# EAGLE design Grove - NFC Tag v1.0 (EAGLE 6.4)

## Sheet 1 of 2
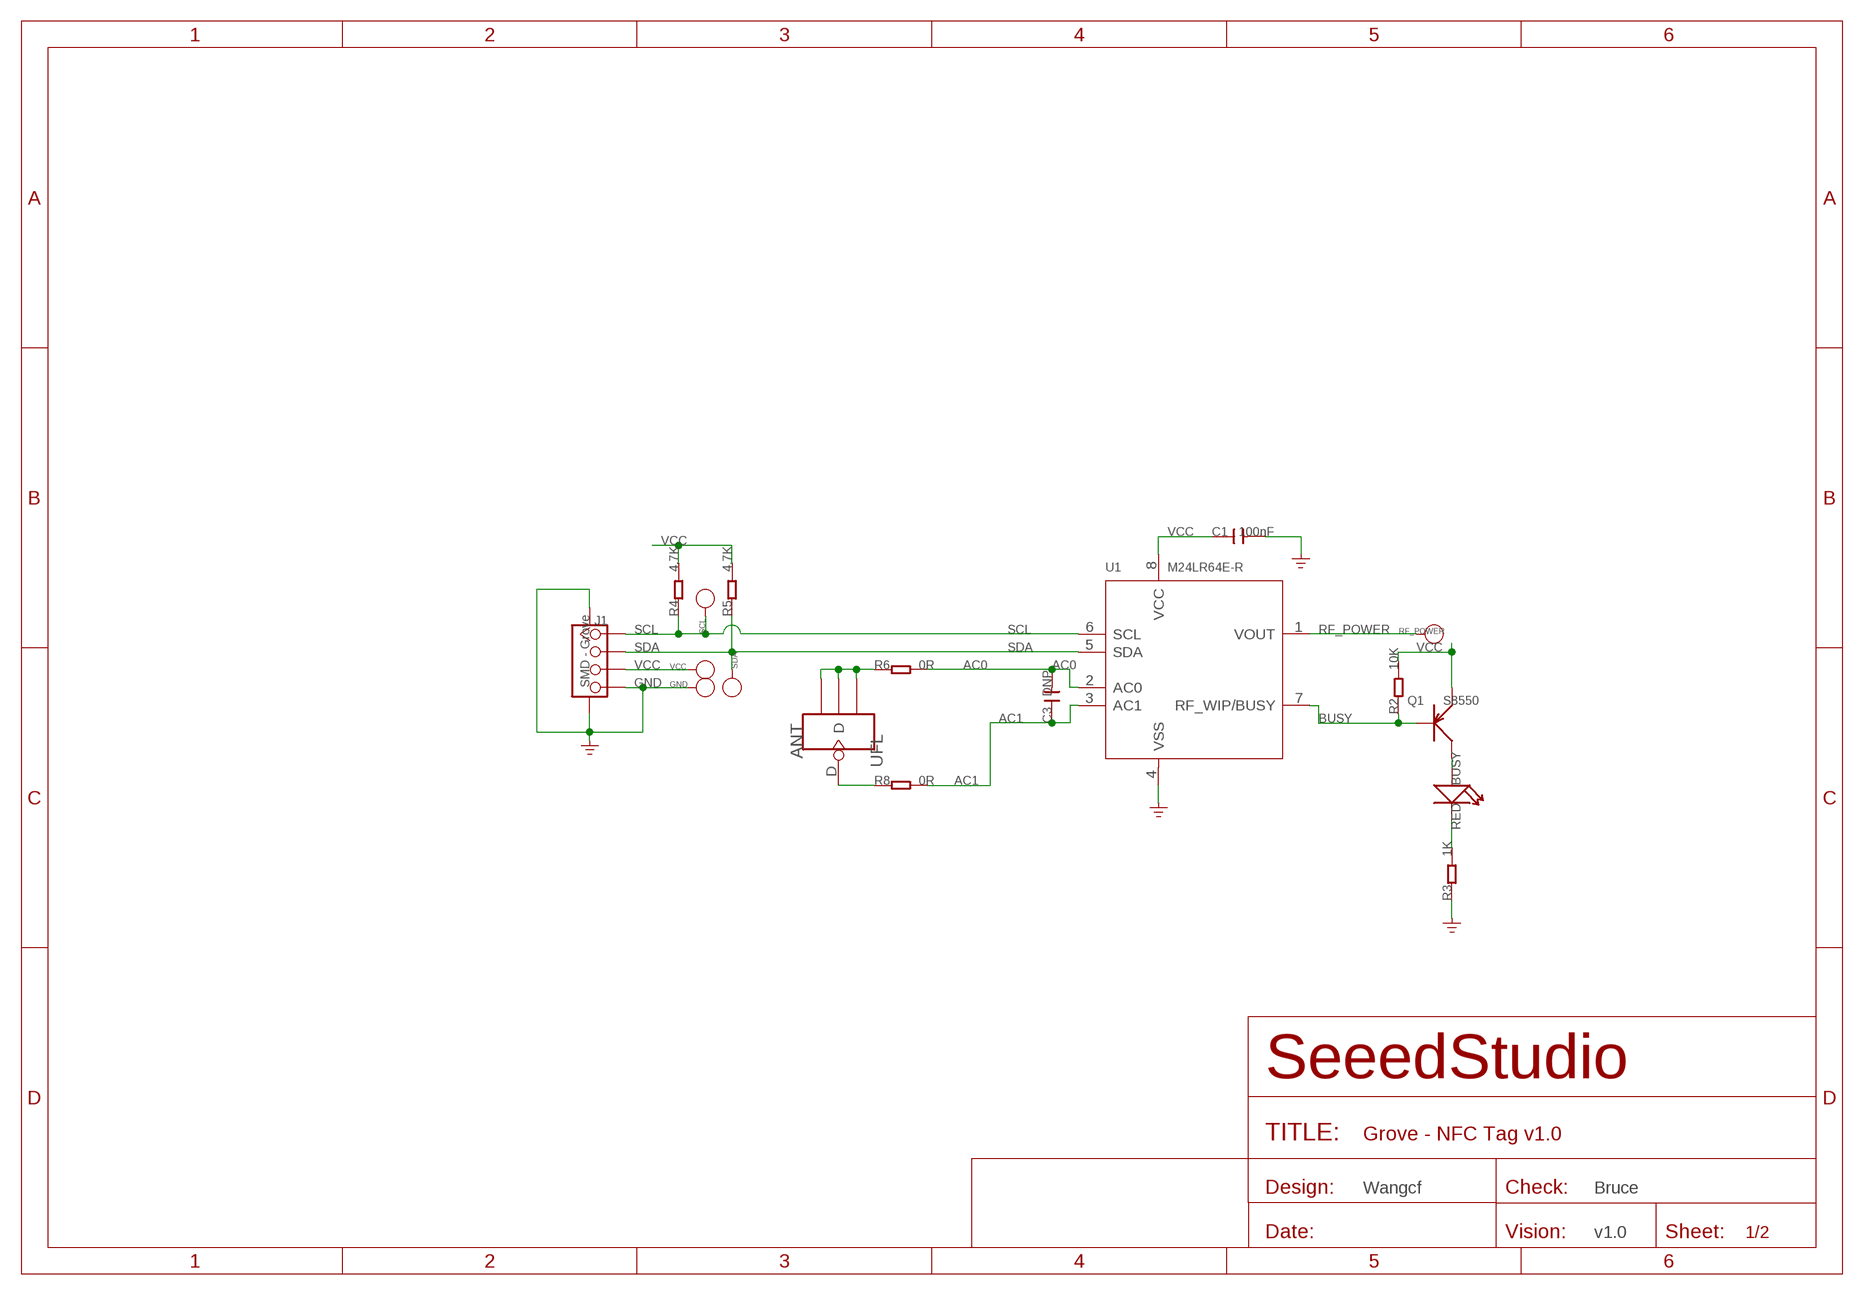
[diagram p0: schematic, sheet 1]

### Parts
ANT  UFL  ANTENNA-U-FL  [4P-U-FL]
BUSY  RED  LED'0603'  [LED-0603]
C1  100nF  C-0402  [C0402]
C3  DNP  C-0402  [C0402]
GND  PAD-TEST-POINT'4545'  [TP_4545]
J1  SMD - Grove  TWIG-4P-2.0-SMD-FEMALE-REINFORCE'DD'  [4P-SMD-2.0]
Q1  S8550  TRANSISTOR-PNP-SOT23  [SOT23]
R2  10K  R-0402  [R0402]
R3  1K  R-0402  [R0402]
R4  4.7K  R-0402  [R0402]
R5  4.7K  R-0402  [R0402]
R6  0R  R-0402  [R0402]
R8  0R  R-0402  [R0402]
RF_POWER  PAD-TEST-POINT'4545'  [TP_4545]
SCL  PAD-TEST-POINT'4545'  [TP_4545]
SDA  PAD-TEST-POINT'4545'  [TP_4545]
U1  M24LR64E-R  [TSSOP8]
VCC  PAD-TEST-POINT'4545'  [TP_4545]

### Nets
AC0: C3.2 R6.2 U1.2(AC0)
AC1: C3.1 R8.2 U1.3(AC1)
BUSY: Q1.1(B) R2.1 U1.7(RF_WIP/BUSY)
GND: C1.2 GND.T J1.4 J1.SS1 J1.SS2 R3.1 U1.4(VSS)
N$3: BUSY.+ Q1.3(C)
N$9: BUSY.- R3.2
N$17: ANT.D R8.1
N$18: ANT.GND1 ANT.GND2 ANT.GND3 R6.1
RF_POWER: RF_POWER.T U1.1(VOUT)
SCL: J1.1 R4.1 SCL.T U1.6(SCL)
SDA: J1.2 R5.1 SDA.T U1.5(SDA)
VCC: C1.1 J1.3 Q1.2(E) R2.2 R4.2 R5.2 U1.8(VCC) VCC.T

### Notes on the sheet
- Wangcf | Bruce
- v1.0

## Sheet 2 of 2
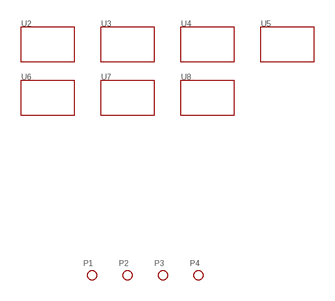
[diagram p1: schematic, sheet 2]

### Parts
P1  PAD-MARK  [ROUND-MARK-1.0]
P2  PAD-MARK  [ROUND-MARK-1.0]
P3  PAD-MARK  [ROUND-MARK-1.0]
P4  PAD-MARK  [ROUND-MARK-1.0]
U2  TWIG'2U'  [GROVE-TEST-PLATFORM]
U3  TWIG'2U'  [GROVE-TEST-PLATFORM]
U4  TWIG'2U'  [GROVE-TEST-PLATFORM]
U5  TWIG'2U'  [GROVE-TEST-PLATFORM]
U6  TWIG'2U'  [GROVE-TEST-PLATFORM]
U7  TWIG'2U'  [GROVE-TEST-PLATFORM]
U8  TWIG'2U'  [GROVE-TEST-PLATFORM]

## Library data of the parts
ANT = Connector:ANTENNA-U-FL
BUSY = Discrete:LED*
C1 C3 = Discrete:C*: Ceramic Capacitors
GND RF_POWER SCL SDA VCC = Discrete:PAD-TEST-POINT; PARTNO: DNP
J1 = Connector :TWIG-4P-2.0-SMD-FEMALE-REINFORCE
P1-P4 = Discrete:PAD-MARK; PARTNO: DNP
Q1 = Discrete:TRANSISTOR-PNP*: PNP audion
R2-R6 R8 = Discrete:R*
U1 = template:M24LR64E-R: Dynamic NFC/RFID tag IC with 64-Kbit EEPROM, energy harvesting, I²C bus and ISO 15693 RF interface
U2-U8 = template:TWIG

## Net classes
0 default: width 0.203 mm, drill 0.305 mm, clearance 0.152 mm

## Board
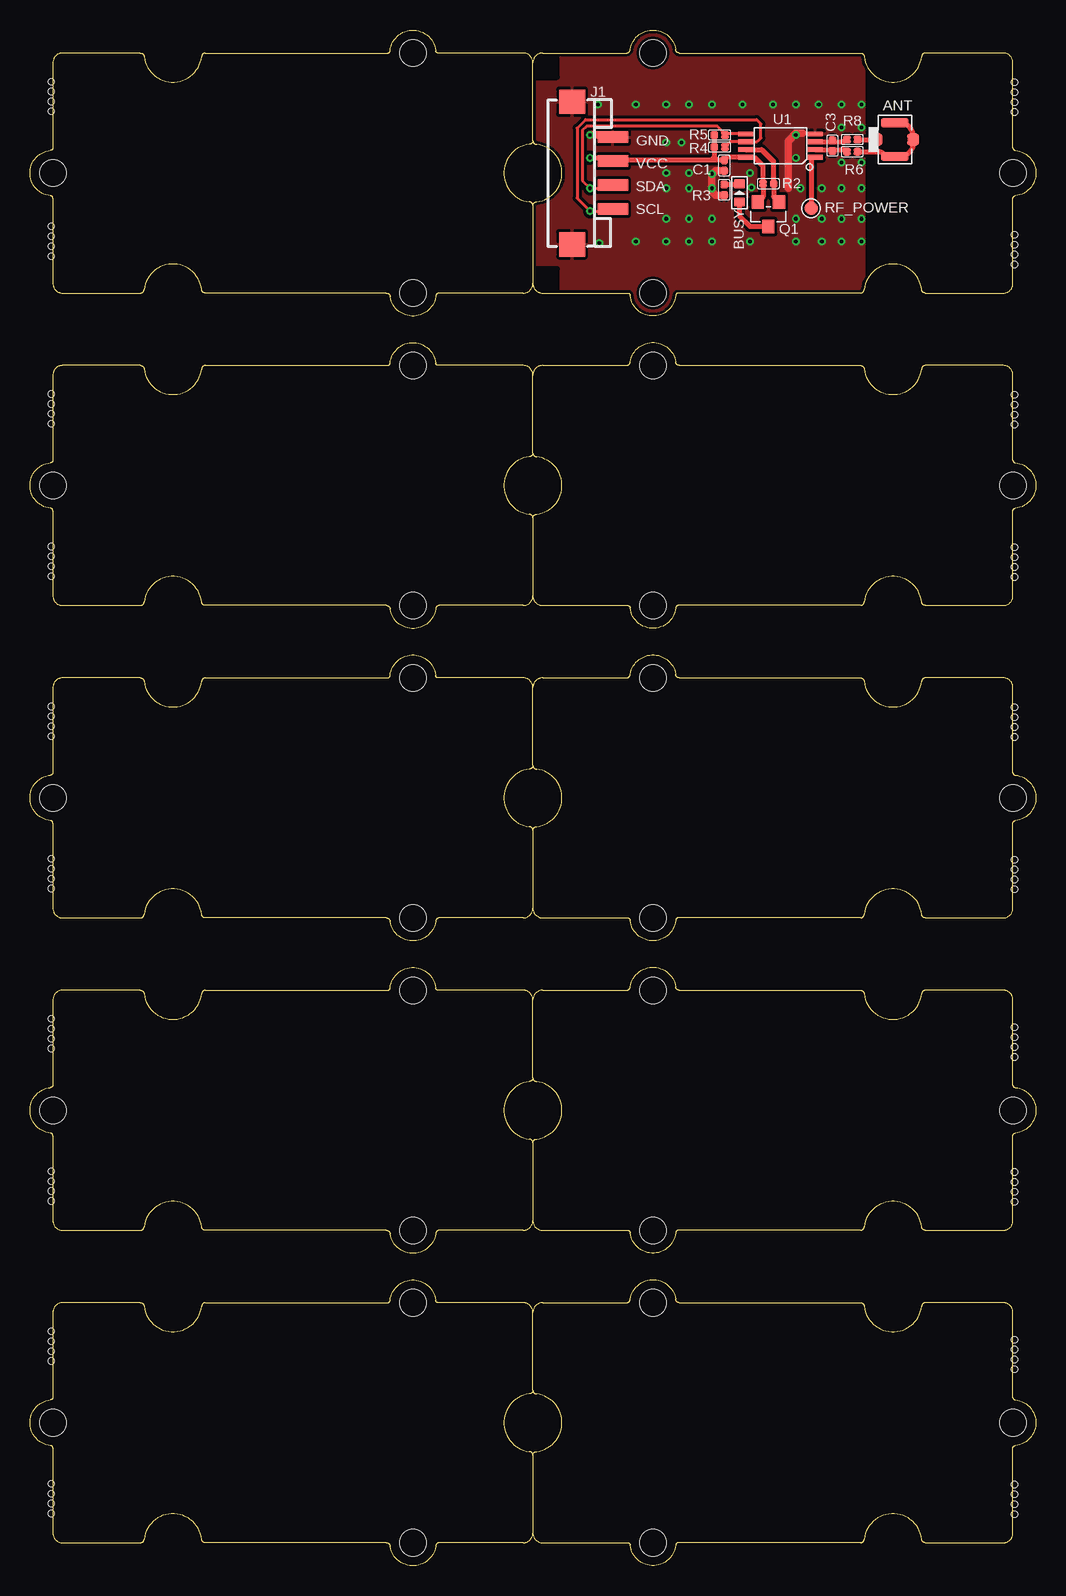
[diagram p2: board, top side]
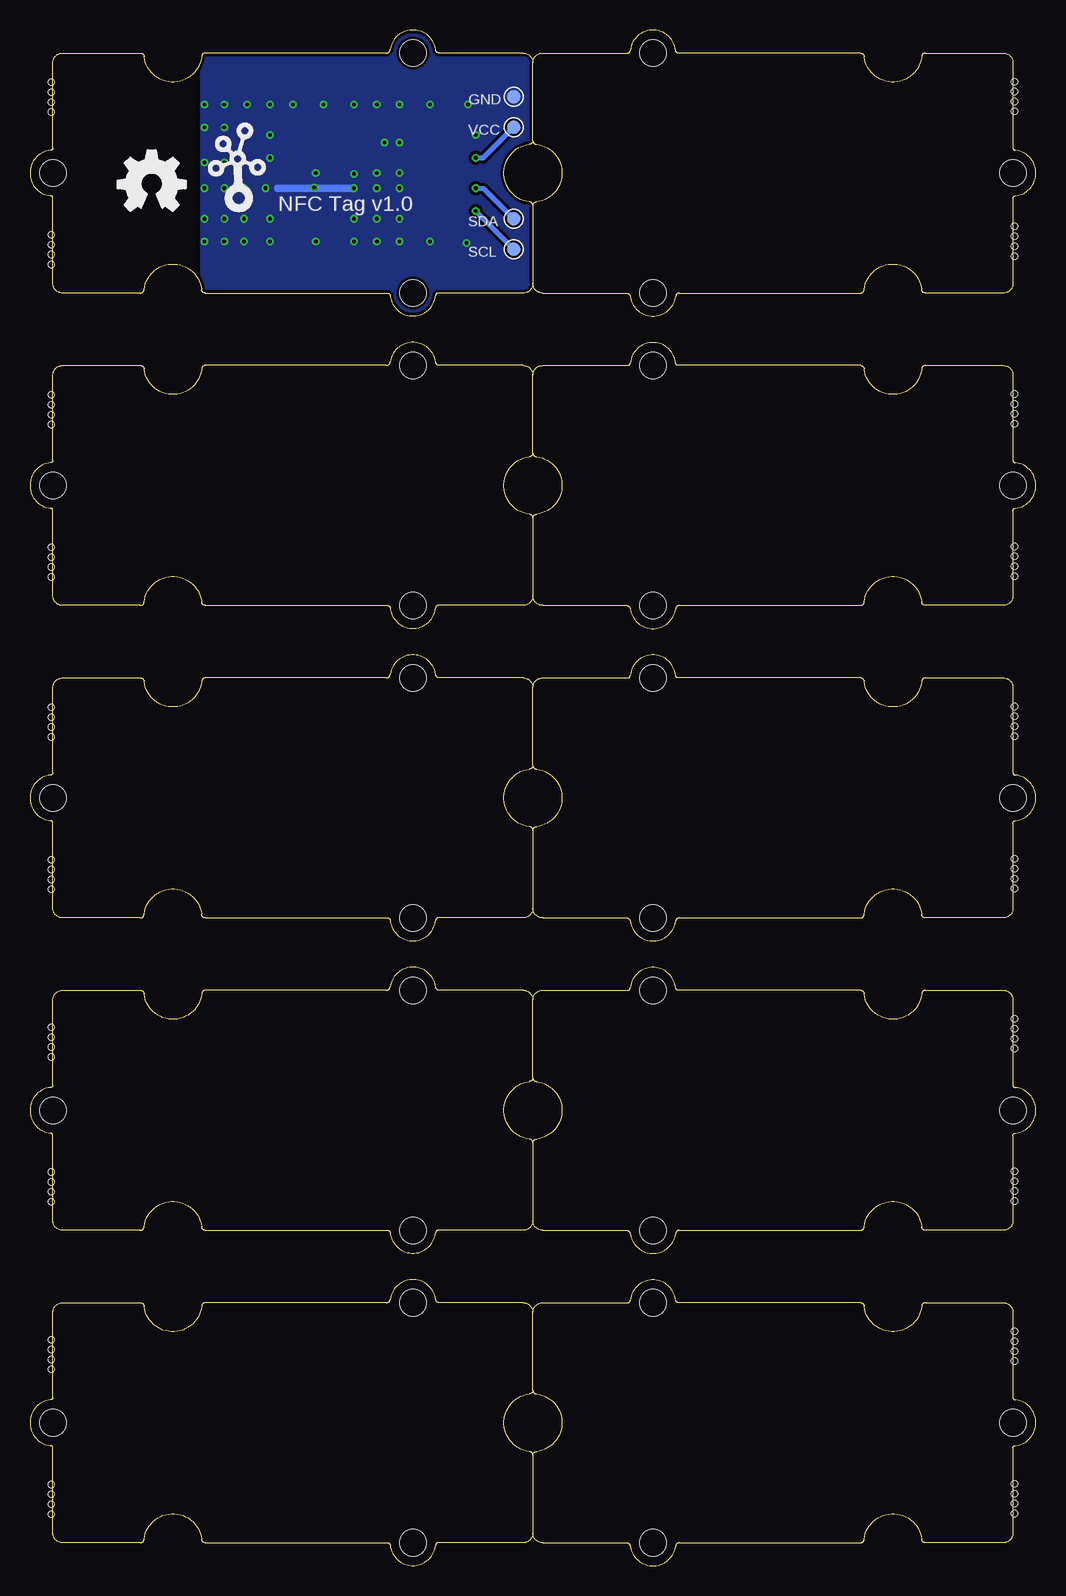
[diagram p3: board, bottom side, seen from below]

Size 83.82 x 127.98 mm. Coordinates in mm from the lower left corner, seen from the top.
Copper layers (1*16): Top 0.035mm / dielectric 1.5mm / Bottom 0.035mm
Design rules "SeeedStudio_2layer_DRU_no_angle_20140221 *": minimum track width 6mil, minimum drill 12mil, track to track 6mil, track to pad 6mil, pad to pad 6mil, via to via 6mil, smd to smd 0mil, copper to edge 10mil, drill to drill 10mil, minimum pad ring 10mil, minimum via ring 6mil, stop-mask expansion 2mil, vias tented up to drill 25mil, thermal gap 10mil
Holes 0.5 mm at 1.78,32.88 1.78,30.4 1.78,31.23 1.78,32.05 1.78,45.58 1.78,43.1 1.78,43.93 1.78,44.75 1.78,58.91 1.78,56.43 1.78,57.26 1.78,58.09 1.78,71.61 1.78,69.13 1.78,69.96 1.78,70.79 1.78,84.95 1.78,82.47 1.78,83.3 1.78,84.12 1.78,97.65 1.78,95.17 1.78,96 1.78,96.82 1.78,111.62 1.78,109.14 1.78,109.97 1.78,110.79 1.78,123.68 1.78,121.2 1.78,122.03 1.78,122.86 82.04,121.14 82.04,123.62 82.04,122.79 82.04,121.97 82.04,108.44 82.04,110.92 82.04,110.09 82.04,109.27 82.04,95.11 82.04,97.58 82.04,96.76 82.04,95.93 82.04,82.41 82.04,84.88 82.04,84.06 82.04,83.23 82.04,69.07 82.04,71.55 82.04,70.72 82.04,69.9 82.04,56.37 82.04,58.85 82.04,58.02 82.04,57.2 82.04,42.4 82.04,44.88 82.04,44.05 82.04,43.23 82.04,30.34 82.04,32.81 82.04,31.99 82.04,31.16 1.78,6.84 1.78,4.36 1.78,5.19 1.78,6.02 1.78,19.54 1.78,17.06 1.78,17.89 1.78,18.72 82.04,16.37 82.04,18.84 82.04,18.02 82.04,17.19 82.04,4.3 82.04,6.78 82.04,5.95 82.04,5.13
Holes 1.91 mm at -4.13,2.4 87.95,2.4 87.95,125.59 -4.13,125.59

### Footprints (pad centres in the part's own frame; a part is rotated, then mirrored left to right if it is on the bottom)
4P-U-FL = smd 1.016 x 1.016: D -1.524,0; GND3 1.524,0 | smd 2.286 x 0.762: GND1 0,1.397; GND2 0,-1.397
LED-0603 = smd 0.762 x 0.889: + -0.762,0; - 0.762,0
C0402 = smd 0.635 x 0.635: 1 -0.445,0; 2 0.445,0
TP_4545 = smd 1.143 x 1.143: T 0,0
4P-SMD-2.0 = smd 0.965 x 2.54: 1 -3,0; 2 -1,0; 3 1,0; 4 3,0 | smd 2.032 x 2.184: SS1 -5.946,3.4; SS2 5.946,3.4
ROUND-MARK-1.0 = smd 1.016 x 1.016: P$1 0,0
SOT23 = smd 1.016 x 1.143: 1 -0.889,-1.016; 2 0.889,-1.016; 3 0,1.016
R0402 = smd 0.635 x 0.635: 1 -0.445,0; 2 0.445,0
TSSOP8 = smd 0.4 x 1.27: 1 -0.975,-2.9; 2 -0.325,-2.9; 3 0.325,-2.9; 4 0.975,-2.9; 5 0.975,2.9; 6 0.325,2.9; 7 -0.325,2.9; 8 -0.975,2.9
GROVE-TEST-PLATFORM = hole 2.2: -10,-10; -10,10; 20,0
GROVE-2CONNECTOR-SMD = hole 2.2: -10,-10; -10,10; 20,0

### Placement (x,y rotation side)
ANT  72.07,118.86 0 top
BUSY  59.12,114.41 90 top
C1  57.85,116.7 270 top
C3  66.87,118.35 270 top
GND  43.5,122.41 180 bottom
J1  48.58,116.06 90 top
P1  -4.13,7.48 0 top  (outside the outline)
P2  87.95,7.48 0 top  (outside the outline)
P3  -4.13,120.51 0 top  (outside the outline)
P4  87.95,120.51 0 top  (outside the outline)
Q1  61.53,112.63 180 top
R2  61.53,115.17 180 top
R3  57.85,114.66 90 top
R4  57.47,118.22 180 top
R5  57.47,119.24 180 top
R6  68.52,117.84 180 top
R8  68.52,118.86 180 top
RF_POWER  65.09,113.14 0 top
SCL  43.5,109.71 180 bottom
SDA  43.5,112.25 180 bottom
U1  62.55,118.35 90 top
U2  61.91,37.96 0 top
U3  21.91,37.96 180 top
U4  61.91,63.99 0 top
U5  21.91,63.99 180 top
U6  61.91,90.03 0 top
U7  21.91,90.03 180 top
U8  21.91,116.06 180 top
U10  [GROVE-TEST-PLATFORM]  61.91,11.92 0 top
U11  [GROVE-TEST-PLATFORM]  21.91,11.92 180 top
U$4  [OSHW_FILLX200_NOTEXT]  76.52,112.89 0 bottom
U$5  [GROVE-2CONNECTOR-SMD]  61.91,116.06 0 top
U$6  [TWIGLOGO]  66.49,113.78 0 bottom
VCC  43.5,119.87 180 bottom

### Tracks (layer width: path | path; a pad name or v marks a point on that pad's centre or on a via)
AC0
  Top 0.254: 66.68,118.02 66.75,118.02 C3.2
  Top 0.406: U1.2 66.68,118.02 67.63,118.02 arc-45 R6.2
AC1
  Top 0.254: 66.68,118.67 66.75,118.67 C3.1
  Top 0.406: U1.3 66.68,118.67 67.63,118.67 arc45 R8.2
BUSY
  Top 0.406: 62.29,113.78 Q1.1 61.98,114.09 R2.1 61.98,117.01 60.97,118.02 U1.7
GND  (via drill 0.3 pad 0.64)
  Top 0.254: 45.07,110.22 J1.SS1
  Top 0.305: U1.4 64.43,119.32 64.39,119.36
  Top 0.61: C1.2 57.15,116.25 56.83,115.93 v56.83,114.79 56.83,114.54 57.15,114.22 R3.1 | 45.07,110.22 44.9,110.22 | J1.4 48.4,119.24 v46.67,119.24 | 63.18,114.79 63.18,118.73 63.82,119.36 64.39,119.36
  Bottom 0.61: v56.83,114.79 63.18,114.79
  other vias: 56.83,116 63.82,119.24 63.82,117.33 63.82,121.78 65.72,121.78 67.63,121.78 69.28,121.78 67.63,119.87 69.28,119.87 64.2,114.79 65.98,114.79 67.63,114.79 69.28,114.79 69.28,116.95 67.63,116.95 53.02,118.6 54.29,118.6 54.93,116.06 53.02,116.06 54.93,114.79 53.02,114.79 56.83,112.25 54.93,112.25 53.02,112.25 53.02,121.78 54.93,121.78 56.83,121.78 59.37,121.78 61.91,121.78 60.01,116.06 60.14,114.85 63.82,112.25 65.98,112.25 67.63,112.25 69.28,112.25 50.48,121.78 47.31,121.78 47.44,110.22 50.48,110.35 53.02,110.35 54.93,110.35 56.83,110.35 60.01,110.35 63.82,110.35 65.98,110.35 67.63,110.35 69.28,110.35
  pour Bottom (isolate 0.254): 41.59,128.13 69.53,128.13 69.53,104 41.59,104
  pour Top (isolate 0.254): 41.59,128.13 69.53,128.13 69.53,104 41.59,104
N$3
  Top 0.406: BUSY.+ 59.12,112.51 60.01,111.62 Q1.3
N$9
  Top 0.406: R3.2 59.06,115.11 BUSY.-
N$17
  Top 0.406: R8.1 ANT.D
N$18
  Top 0.406: 71.95,117.33 ANT.GND2 | ANT.GND1 72.46,120.25 arc-90 73.6,119.12 ANT.GND3 73.6,118.54 arc-90 72.52,117.46 ANT.GND2 | R6.1 70.76,117.84 arc-45 71.05,117.72 71.31,117.46 ANT.GND2
RF_POWER
  Top 0.406: U1.1 65.13,117.37 65.09,117.33 RF_POWER.T
SCL  (via drill 0.3 pad 0.64)
  Top 0.254: J1.1 48.4,112.89 v46.67,112.89 45.59,113.97 45.59,119.81 46.29,120.51 60.56,120.51 60.9,120.16 60.9,118.98 60.59,118.67 U1.6 58.36,118.67 R4.1
  Bottom 0.406: 43.5,109.81 SCL.T v46.67,112.89
SDA  (via drill 0.3 pad 0.64)
  Top 0.254: U1.5 57.89,119.32 | J1.2 48.31,114.79 v46.67,114.79 46.04,115.43 46.04,119.62 46.42,120 57.21,120 57.89,119.32 | R5.1 57.91,119.27 arc45 57.89,119.32
  Bottom 0.406: v46.67,114.79 46.04,114.79 SDA.T
VCC  (via drill 0.3 pad 0.64)
  Top 0.406: R5.2 R4.2 57.02,117.43 57.02,117.39 | 60.77,113.78 Q1.2 61.09,114.09 R2.2 61.09,116.63 60.35,117.37 U1.8 58.08,117.37 C1.1 56.96,117.14 | v46.67,117.33 48.31,117.33 J1.3 48.66,117.14 56.77,117.14 | 56.96,117.14 56.77,117.14 | 57.02,117.39 57.02,117.2 56.96,117.14 | 56.77,117.14 56.96,117.33 | 57.02,117.39 57.21,117.2
  Bottom 0.406: v46.67,117.33 46.04,117.33 VCC.T

### Text on the board
tPlace: GND | VCC | SDA | SCL
bPlace: NFC Tag v1.0